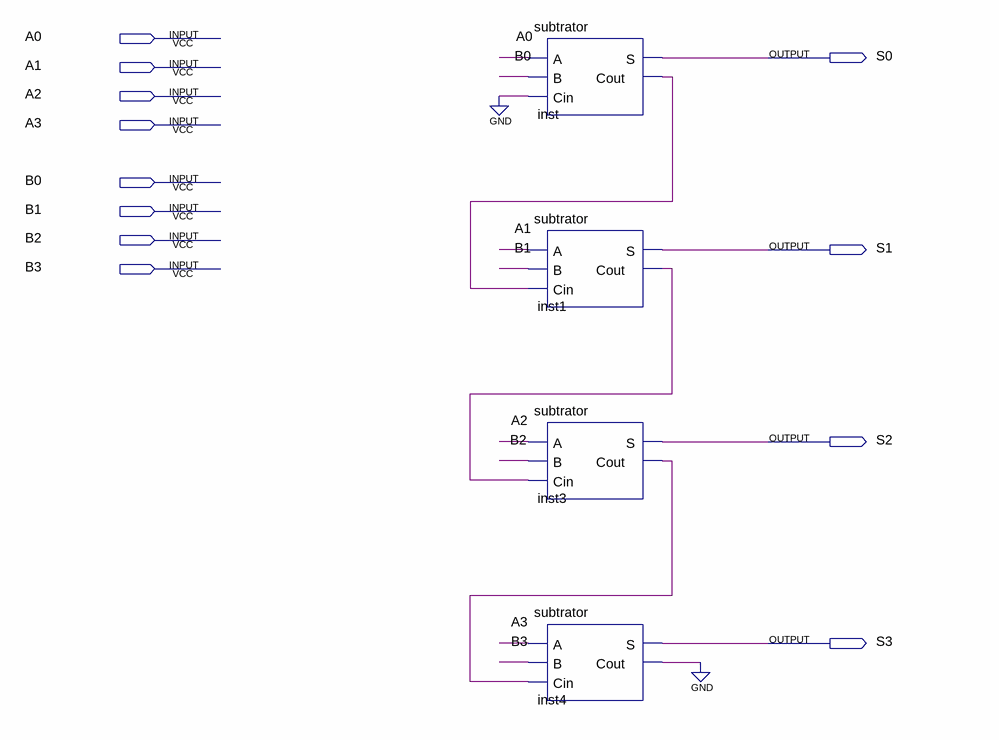
[diagram p0: schematic sheet]
// Quartus schematic subtrator4bits.bdf as structural Verilog: 4 symbols, 12 pins
module subtrator4bits (
  input  A0,
  input  A1,
  input  A2,
  input  A3,
  input  B0,
  input  B1,
  input  B2,
  input  B3,
  output S0,
  output S1,
  output S2,
  output S3
);

  wire inst1_cout, inst3_cout, inst4_cout, inst_cout;

  subtrator inst (.A(A0), .B(B0), .Cin(1'b0), .S(S0), .Cout(inst_cout));
  subtrator inst1 (.A(A1), .B(B1), .Cin(inst_cout), .S(S1), .Cout(inst1_cout));
  subtrator inst3 (.A(A2), .B(B2), .Cin(inst1_cout), .S(S2), .Cout(inst3_cout));
  subtrator inst4 (.A(A3), .B(B3), .Cin(inst3_cout), .S(S3), .Cout(inst4_cout));
  // also tied to GND on the sheet: inst4_cout
endmodule
